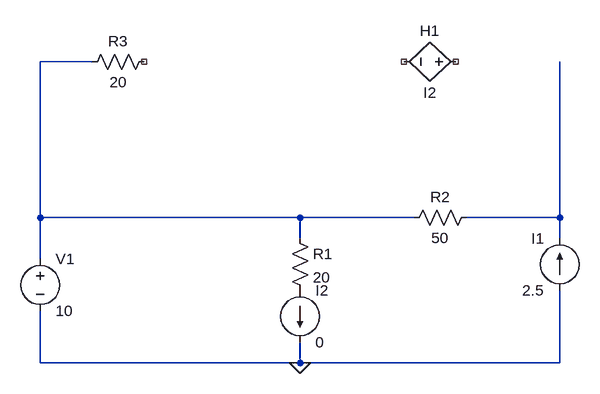
[diagram p0: schematic Draft1.asc]
Draft1.asc, the LTspice schematic file:
Version 4
SHEET 1 880 680
WIRE 0 -96 -80 -96
WIRE -80 144 -80 -96
WIRE 320 144 -80 144
WIRE 496 144 320 144
WIRE 720 144 720 -96
WIRE 720 144 576 144
WIRE 320 176 320 144
WIRE 720 176 720 144
WIRE -80 208 -80 144
WIRE -80 368 -80 288
WIRE 320 368 320 336
WIRE 320 368 -80 368
WIRE 720 368 720 256
WIRE 720 368 320 368
FLAG 320 368 0
SYMBOL res 592 128 R90
WINDOW 0 0 56 VBottom 2
WINDOW 3 32 56 VTop 2
SYMATTR InstName R2
SYMATTR Value 50
SYMBOL current 720 256 R180
WINDOW 0 24 80 Left 2
WINDOW 3 24 0 Left 2
WINDOW 123 0 0 Left 0
WINDOW 39 0 0 Left 0
SYMATTR InstName I1
SYMATTR Value 2.5
SYMBOL res 304 160 R0
SYMATTR InstName R1
SYMATTR Value 20
SYMBOL voltage -80 192 R0
SYMATTR InstName V1
SYMATTR Value 10
SYMBOL res 96 -112 R90
WINDOW 0 0 56 VBottom 2
WINDOW 3 32 56 VTop 2
SYMATTR InstName R3
SYMATTR Value 20
SYMBOL h 576 -96 R90
WINDOW 0 -32 56 VBottom 2
WINDOW 3 32 56 VTop 2
SYMATTR InstName H1
SYMATTR Value I2
SYMBOL current 320 256 R0
SYMATTR InstName I2
SYMATTR Value 0

The netlist it stands for:
* Draft1.asc
R2 N002 N001 50
I1 0 N002 2.5
R1 N001 P001 20
V1 N001 0 10
R3 NC_01 N001 20
H1 NC_02 NC_03 I2
I2 P001 0 0
.backanno
.end